# EAGLE design MouseGoggles MonoHat-1-0 (EAGLE 9.6.2)
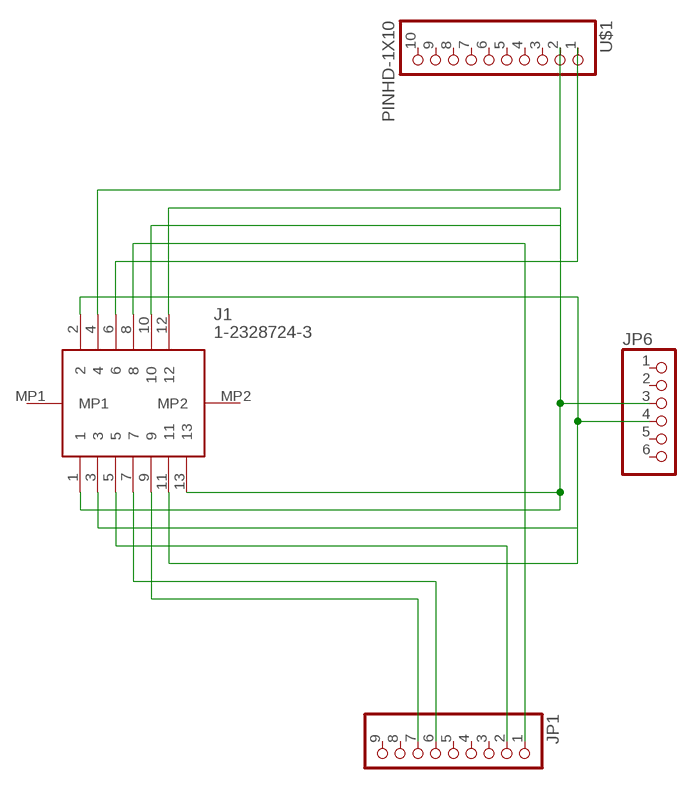
[diagram p0: schematic, sheet 1]

## Parts
J1  1-2328724-3  [123287243]
JP1  PINHD-1X9  [1X09-BIG]
JP6  PINHD-1X6B  [1X06-BIG]
U$1  PINHD-1X10  [1X10-BIG]

## Nets
N$1: J1.1 J1.10 J1.12 J1.13 JP6.3
N$2: J1.2 J1.3 J1.11 JP6.4
N$3: J1.5 JP1.2
N$4: J1.6 U$1.1
N$5: J1.8 JP1.1
N$6: J1.4 U$1.2
N$7: J1.7 JP1.6
N$8: J1.9 JP1.7
Unconnected: J1.MP1 J1.MP2 JP1.3 JP1.4 JP1.5 JP1.8 JP1.9 JP6.1 JP6.2 JP6.5 JP6.6 U$1.3 U$1.4 U$1.5 U$1.6 U$1.7 U$1.8 U$1.9 U$1.10

## Library data of the parts
J1 = 1-2328724-3:1-2328724-3: AMP - TE CONNECTIVITY - 1-2328724-3 - CONNECTOR, FPC, R/A, 13POS, 1ROW, 0.3MM Source: Datasheet <https://www.te.com/commerce/DocumentDelivery/DDEController?Action=showdoc&DocId=Customer Drawing23287243pdfEnglishENG_CD_2328724_3.pdf1-2328724-3>; DESCRIPTION: AMP - TE CONNECTIVITY - 1-2328724-3 - CONNECTOR, FPC, R/A, 13POS, 1ROW, 0.3MM; HEIGHT: 1.1mm; MANUFACTURER_NAME: TE Connectivity; MANUFACTURER_PART_NUMBER: 1-2328724-3; MOUSER_PART_NUMBER: 571-1-2328724-3; MOUSER_PRICE-STOCK: https://www.mouser.co.uk/ProductDetail/TE-Connectivity/1-2328724-3?qs=w%2Fv1CP2dgqo8aBCjMy0R7g%3D%3D
JP1 = adafruit:PINHD-1X9: Pin header 1x10 0.1" spacing With round pins
JP6 = adafruit:PINHD-1X6: PIN HEADER
U$1 = adafruit:PINHD-1X10: Pin header 1x10 0.1" spacing With round pins

## Board
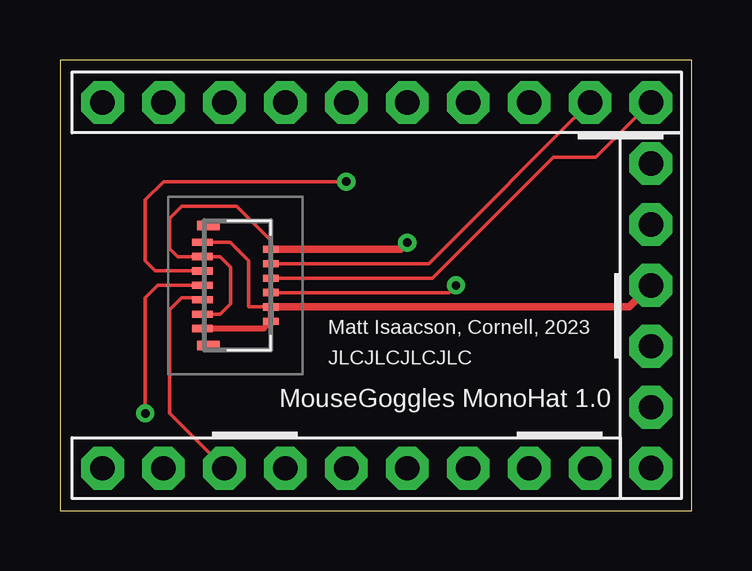
[diagram p1: board, top side]
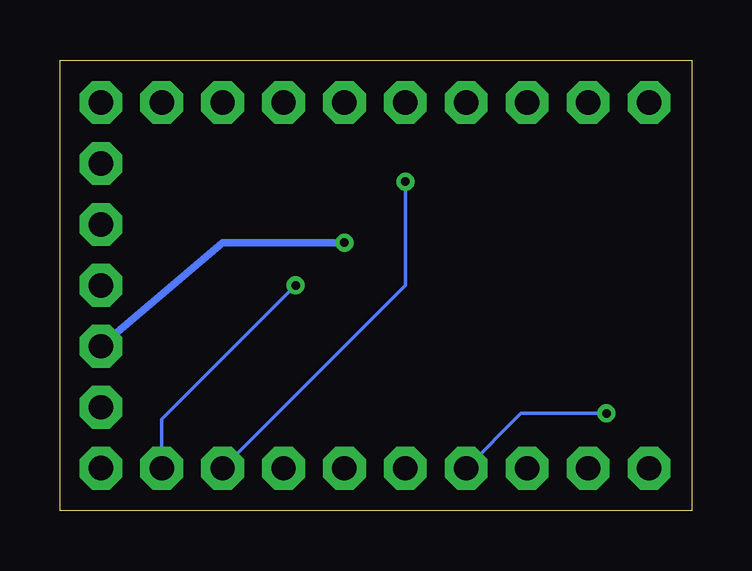
[diagram p2: board, bottom side, seen from below]

Size 26.34 x 18.79 mm. Coordinates in mm from the lower left corner, seen from the top.
Outline: 0,0 26.34,0 26.34,18.79 0,18.79 0,0
Copper layers (1*16): Top 0.035mm / dielectric 1.5mm / Bottom 0.035mm
Design rules "default": minimum track width 6mil, minimum drill 0.35mm, track to track 6mil, track to pad 6mil, pad to pad 6mil, via to via 6mil, smd to smd 6mil, copper to edge 40mil, drill to drill 6mil, minimum pad ring 10mil, minimum via ring 8mil, stop-mask expansion 4mil, vias tented up to drill 0mil, thermal gap 10mil

### Footprints (pad centres in the part's own frame; a part is rotated, then mirrored left to right if it is on the bottom)
123287243 = smd 0.3 x 0.85: 1 -1.8,-1.425; 3 -1.2,-1.425; 5 -0.6,-1.425; 7 0,-1.425; 9 0.6,-1.425; 11 1.2,-1.425; 13 1.8,-1.425 | smd 0.3 x 0.65: 2 -1.5,1.425; 4 -0.9,1.425; 6 -0.3,1.425; 8 0.3,1.425; 10 0.9,1.425; 12 1.5,1.425 | smd 0.4 x 0.95: MP1 -2.5,-1.175; MP2 2.5,-1.175
1X09-BIG = drill 1.016 pad 1.778 octagon: 1 -10.16,0; 2 -7.62,0; 3 -5.08,0; 4 -2.54,0; 5 0,0; 6 2.54,0; 7 5.08,0; 8 7.62,0; 9 10.16,0
1X06-BIG = drill 1.016 pad 1.778 octagon: 1 -6.35,0; 2 -3.81,0; 3 -1.27,0; 4 1.27,0; 5 3.81,0; 6 6.35,0
1X10-BIG = drill 1.016 pad 1.778 octagon: 1 -11.43,0; 2 -8.89,0; 3 -6.35,0; 4 -3.81,0; 5 -1.27,0; 6 1.27,0; 7 3.81,0; 8 6.35,0; 9 8.89,0; 10 11.43,0

### Placement (x,y rotation side)
J1  7.37,9.4 270 top
JP1  11.94,1.78 180 top
JP6  24.64,8.13 270 top
U$1  13.21,17.02 180 top

### Tracks (layer width: path | path; a pad name or v marks a point on that pad's centre or on a via)
N$1
  Top 0.152: J1.1 7.09,11.2 7.87,10.41 7.87,8.5 J1.10
  Top 0.254: J1.13 8.49,7.6 J1.12 J1.10
  Top 0.305: J1.10 23.74,8.5 JP6.3
N$2  (via drill 0.35)
  Top 0.152: 5.87,10.67 J1.3 4.9,10.6 4.57,10.92 4.57,12.19 5.08,12.7 7.37,12.7 8.79,11.27 J1.2 | J1.11 6.67,8.2 7.11,8.64 7.11,10.16 6.67,10.6 5.66,10.6
  Top 0.254: 5.66,10.6 J1.3
  Top 0.305: J1.2 14.2,10.9 v14.48,11.18
  Bottom 0.305: v14.48,11.18 19.56,11.18 JP6.4
N$3  (via drill 0.35)
  Top 0.152: v11.94,13.72 4.32,13.72 3.56,12.95 3.56,10.41 3.97,10 J1.5
  Bottom 0.152: JP1.2 11.94,9.4 v11.94,13.72
N$4
  Top 0.152: U$1.1 22.35,14.73 20.57,14.73 15.54,9.7 J1.6
N$5  (via drill 0.35)
  Top 0.152: J1.8 16.21,9.1 v16.51,9.4
  Bottom 0.152: v16.51,9.4 22.1,3.81 JP1.1
N$6
  Top 0.152: J1.4 15.38,10.3 U$1.2
N$7  (via drill 0.35)
  Top 0.152: J1.7 4.06,9.4 3.56,8.89 v3.56,4.06
  Bottom 0.152: v3.56,4.06 7.11,4.06 JP1.6
N$8
  Top 0.152: J1.9 5.85,8.89 5.08,8.89 4.57,8.38 4.57,4.06 JP1.7

### Text on the board
tNames: Matt Isaacson, Cornell, 2023 | JLCJLCJLCJLC | MouseGoggles MonoHat 1.0